# Altium project MB1936.PrjPcb (part 3 of 8)

## Sheet Ethernet2.SchDoc: ETHERNET 2
size A3; Date: Not used; ApprovedBy: Not used; CheckedBy: Not used; Author: Not used; CompanyName: STMicroelectronics; DrawnBy: Not used; Engineer: Not used; Organization: Not used; Address1: Not used; Address2: Not used; Address3: Not used; Address4: Not used; DocumentNumber: Not used; Revision: Not used; SheetNumber: 8; SheetTotal: 18; CurrentTime: Not used; CurrentDate: Not used; Time: Not used; DocumentFullPathAndName: Not used; DocumentName: Not used; ModifiedDate: Not used; ImagePath: Not used; ProjectName: Not used; Application_BuildNumber: Not used
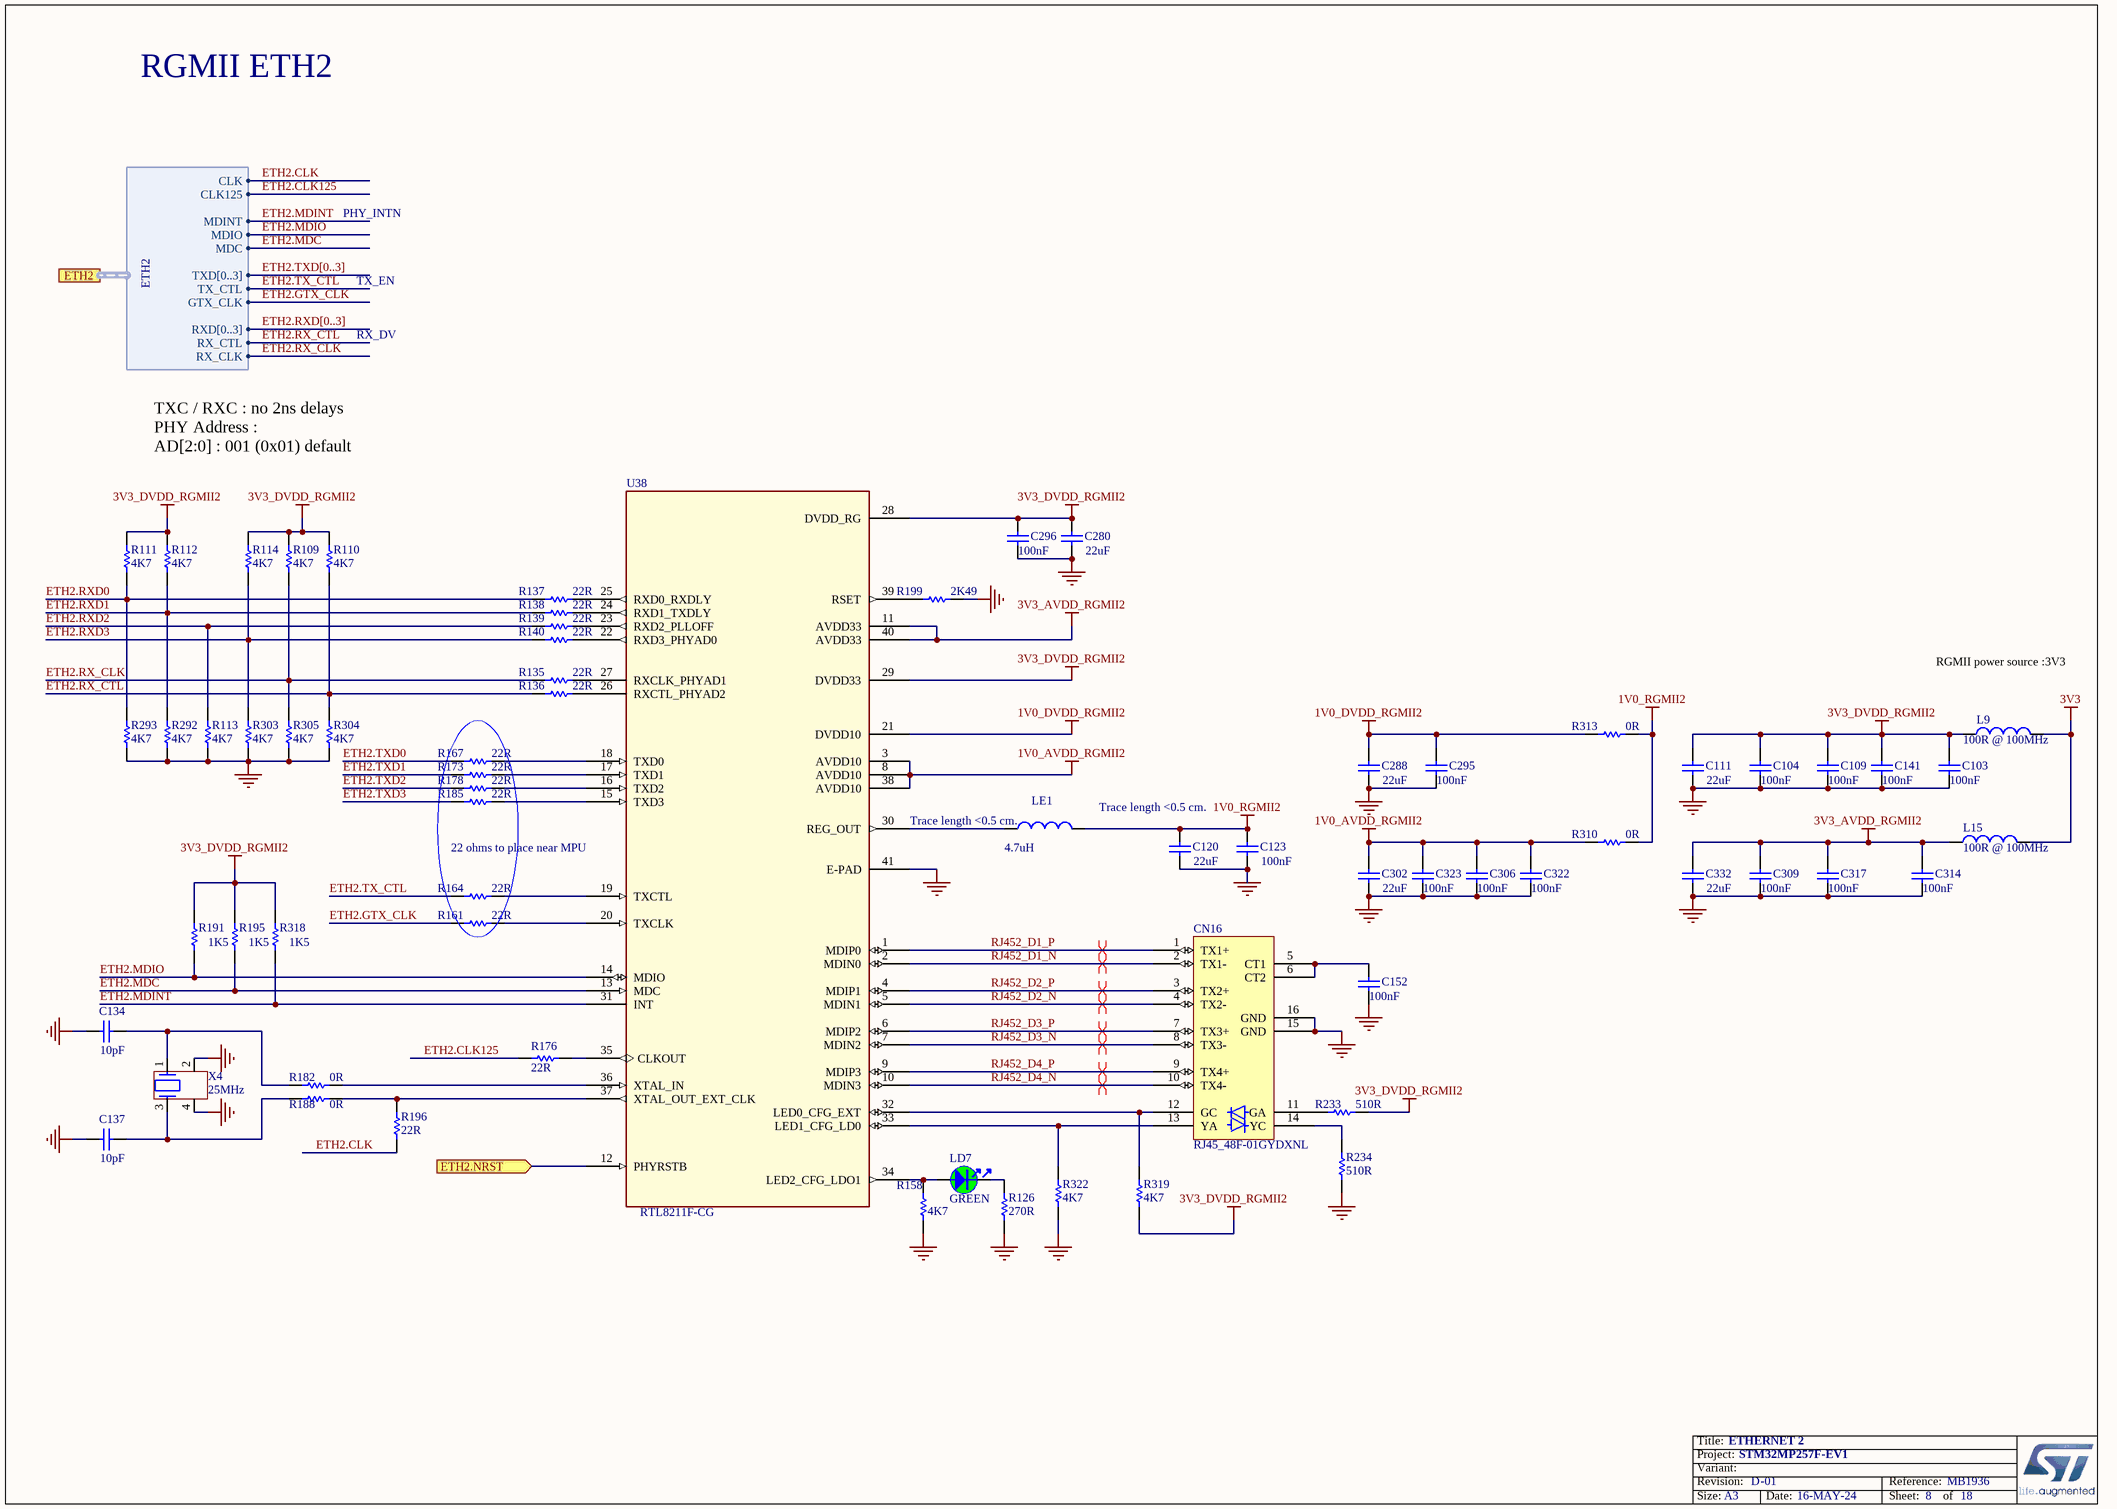
[diagram p7: Ethernet2.SchDoc]

### Parts
C103  value 100nF  [C0402]
C104  value 100nF  [C0402]
C109  value 100nF  [C0402]
C111  value 22uF  [C0603]
C120  value 22uF  [C0603]
C123  value 100nF  [C0402]
C134  value 10pF  [C0402]
C137  value 10pF  [C0402]
C141  value 100nF  [C0402]
C152  value 100nF  [C0402]
C280  value 22uF  [C0603]
C288  value 22uF  [C0603]
C295  value 100nF  [C0402]
C296  value 100nF  [C0402]
C302  value 22uF  [C0603]
C306  value 100nF  [C0402]
C309  value 100nF  [C0402]
C314  value 100nF  [C0402]
C317  value 100nF  [C0402]
C322  value 100nF  [C0402]
C323  value 100nF  [C0402]
C332  value 22uF  [C0603]
CN16  value RJ45_48F-01GYDXNL  [CON_RJ45_YD_48F-01GYDXNL_LED-P]  (hidden comment: ​New part for use of led pulled down on pin 13/14 , schematic more lisible.)
L9  value 100R @ 100MHz  [FIL_0603_H0P65]
L15  value 100R @ 100MHz  [FIL_0603_H0P65]
LD7  value GREEN  [LED_0603_OSRAM_LG-Q396-PS-35_GREEN_1A2K_H0P4]  (hidden comment: LED_green)
LE1  value 4.7uH  [L1210_LQH]
R109  value 4K7  [R0402]
R110  value 4K7  [R0402]
R111  value 4K7  [R0402]
R112  value 4K7  [R0402]
R113  value 4K7  [R0402]
R114  value 4K7  [R0402]
R126  value 270R  [R0402]  (hidden comment: Resistor)
R135  value 22R  [R0201_H0P23]  (hidden comment: Resistor)
R136  value 22R  [R0201_H0P23]  (hidden comment: Resistor)
R137  value 22R  [R0201_H0P23]  (hidden comment: Resistor)
R138  value 22R  [R0201_H0P23]  (hidden comment: Resistor)
R139  value 22R  [R0201_H0P23]  (hidden comment: Resistor)
R140  value 22R  [R0201_H0P23]  (hidden comment: Resistor)
R158  value 4K7  [R0402]
R161  value 22R  [R0201_H0P23]  (hidden comment: Resistor)
R164  value 22R  [R0201_H0P23]  (hidden comment: Resistor)
R167  value 22R  [R0201_H0P23]  (hidden comment: Resistor)
R173  value 22R  [R0201_H0P23]  (hidden comment: Resistor)
R176  value 22R  [R0201_H0P23]  (hidden comment: Resistor)
R178  value 22R  [R0201_H0P23]  (hidden comment: Resistor)
R182  value 0R  [R0402]
R185  value 22R  [R0201_H0P23]  (hidden comment: Resistor)
R188  value 0R  [R0402]
R191  value 1K5  [R0402]
R195  value 1K5  [R0402]
R196  value 22R  [R0201_H0P23]  (hidden comment: Resistor)
R199  value 2K49  [R0402]
R233  value 510R  [R0402]
R234  value 510R  [R0402]
R292  value 4K7  [R0402]
R293  value 4K7  [R0402]
R303  value 4K7  [R0402]
R304  value 4K7  [R0402]
R305  value 4K7  [R0402]
R310  value 0R  [R0603]
R313  value 0R  [R0603]
R318  value 1K5  [R0402]
R319  value 4K7  [R0402]
R322  value 4K7  [R0402]
U38  RTL8211F-CG  [ICC_QFN40-EPAD_5X5_P040]
X4  value 25MHz  [CRY_NX3225HA_4P]  (hidden comment: XTAL_4_PINS)

### Ports
ETH2 (harness ETH2), ETH2.NRST (in)

### Harnesses
ETH2: MDINT, CLK125, TXD[0..3], MDIO, MDC, RX_CLK, GTX_CLK, TX_CTL, RXD[0..3], RX_CTL, CLK

### Nets
1V0_AVDD_RGMII2: C302.2 C306.2 C322.2 C323.2 R310.1 U38.3(AVDD10) U38.8(AVDD10) U38.38(AVDD10)
1V0_DVDD_RGMII2: C288.2 C295.2 R313.1 U38.21(DVDD10)
1V0_RGMII2: C120.2 C123.2 LE1.2 R310.2 R313.2
3V3: L9.2 L15.2
3V3_AVDD_RGMII2: C309.2 C314.2 C317.2 C332.2 L15.1 U38.11(AVDD33) U38.40(AVDD33)
3V3_DVDD_RGMII2: C103.2 C104.2 C109.2 C111.2 C141.2 C280.1 C296.2 L9.1 R109.2 R110.2 R111.2 R112.2 R114.2 R191.2 R195.2 R233.2 R318.2 R319.1 U38.28(DVDD_RG) U38.29(DVDD33)
GND: C103.1 C104.1 C109.1 C111.1 C120.1 C123.1 C134.1 C137.1 C141.1 C152.1 C280.2 C288.1 C295.1 C296.1 C302.1 C306.1 C309.1 C314.1 C317.1 C322.1 C323.1 C332.1 CN16.15(GND) CN16.16(GND) R113.1 R126.2 R158.1 R199.2 R234.1 R292.1 R293.1 R303.1 R304.1 R305.1 R322.1 U38.41(E-PAD) X4.2 X4.4
ETH2.CLK: R196.1 ; port ETH2.CLK
ETH2.CLK125: R176.1 ; port ETH2.CLK125
ETH2.GTX_CLK: R161.1 ; port ETH2.GTX_CLK
ETH2.MDC: R195.1 U38.13(MDC) ; port ETH2.MDC
ETH2.MDINT: R318.1 U38.31(INT) ; port ETH2.MDINT
ETH2.MDIO: R191.1 U38.14(MDIO) ; port ETH2.MDIO
ETH2.NRST: U38.12(PHYRSTB) ; port ETH2.NRST
ETH2.RX_CLK: R109.1 R135.1 R305.2 ; port ETH2.RX_CLK
ETH2.RX_CTL: R110.1 R136.1 R304.2 ; port ETH2.RX_CTL
ETH2.RXD0: R111.1 R137.1 R293.2
ETH2.RXD1: R112.1 R138.1 R292.2
ETH2.RXD2: R113.2 R139.1
ETH2.RXD3: R114.1 R140.1 R303.2
ETH2.TX_CTL: R164.1 ; port ETH2.TX_CTL
ETH2.TXD0: R167.1
ETH2.TXD1: R173.1
ETH2.TXD2: R178.1
ETH2.TXD3: R185.1
RJ452_D1_N: CN16.2(TX1-) U38.2(MDIN0)
RJ452_D1_P: CN16.1(TX1+) U38.1(MDIP0)
RJ452_D2_N: CN16.4(TX2-) U38.5(MDIN1)
RJ452_D2_P: CN16.3(TX2+) U38.4(MDIP1)
RJ452_D3_N: CN16.8(TX3-) U38.7(MDIN2)
RJ452_D3_P: CN16.7(TX3+) U38.6(MDIP2)
RJ452_D4_N: CN16.10(TX4-) U38.10(MDIN3)
RJ452_D4_P: CN16.9(TX4+) U38.9(MDIP3)
NetC134_2: C134.2 R182.1 X4.1
NetC137_2: C137.2 R188.1 X4.3
NetC152_2: C152.2 CN16.5(CT1) CN16.6(CT2)
NetCN16_11: CN16.11(GA) R233.1
NetCN16_12: CN16.12(GC) R319.2 U38.32(LED0_CFG_EXT)
NetCN16_13: CN16.13(YA) R322.2 U38.33(LED1_CFG_LD0)
NetCN16_14: CN16.14(YC) R234.2
NetLD7_1: LD7.1 R158.2 U38.34(LED2_CFG_LDO1)
NetLD7_2: LD7.2 R126.1
NetLE1_1: LE1.1 U38.30(REG_OUT)
NetR135_2: R135.2 U38.27(RXCLK_PHYAD1)
NetR136_2: R136.2 U38.26(RXCTL_PHYAD2)
NetR137_2: R137.2 U38.25(RXD0_RXDLY)
NetR138_2: R138.2 U38.24(RXD1_TXDLY)
NetR139_2: R139.2 U38.23(RXD2_PLLOFF)
NetR140_2: R140.2 U38.22(RXD3_PHYAD0)
NetR161_2: R161.2 U38.20(TXCLK)
NetR164_2: R164.2 U38.19(TXCTL)
NetR167_2: R167.2 U38.18(TXD0)
NetR173_2: R173.2 U38.17(TXD1)
NetR176_2: R176.2 U38.35(CLKOUT)
NetR178_2: R178.2 U38.16(TXD2)
NetR182_2: R182.2 U38.36(XTAL_IN)
NetR185_2: R185.2 U38.15(TXD3)
NetR188_2: R188.2 R196.2 U38.37(XTAL_OUT_EXT_CLK)
NetR199_1: R199.1 U38.39(RSET)

### Buses and harness runs
bus ETH2.RXD[0..3]
bus ETH2.TXD[0..3]

### Layout directives
differential pair: RJ452_D1_N, RJ452_D1_P, RJ452_D2_N, RJ452_D2_P, RJ452_D3_N, RJ452_D3_P, RJ452_D4_N, RJ452_D4_P

### Notes on the sheet
- RGMII ETH2
- PHY_INTN
- TX_EN
- RX_DV
- TXC / RXC : no 2ns delays
  PHY Address :
  AD[2:0] : 001 (0x01) default
- RGMII power source :3V3
- (near U38) 22 ohms to place near MPU
- (near LE1) Trace length <0.5 cm.
- Trace length <0.5 cm.
- Title:
- Project:
- Size:
- Revision:
- Variant:
- A3
- -
- Date:
- Reference:
- Sheet:
- of

### Library data of the parts
C103 C104 C109 C123 C141 C152 C295 C296 C306 C309 C314 C317 C322 C323 = MCD-00006: Capacitor,100nF,16V,X7R,10%,0402; Manufacturer_Part_Number: CC0402KRX7R7BB104; Manufacturer: YAGEO; Alternate_Manufacturer: MURATA; Alternate_Manufacturer_Part_Number: GCM155R71C104KA55D; Part_Preference: Recommended; Provided_By: SUBCO; Initial_Board_Reference: mb1274; Order_Code_RS: 616-9701; Component_Country_Of_Origin: China; ID: 2474; ShowFields: YES; Internal_Part_Number: MCD-00006; ComponentLink1Description: Datasheet; ECCN_US: n/a; ECCN_EU: n/a; Status: Released; Part_Type: Capacitor; Package: 0402; ComponentLink1URL: http://tunmcdsvn.tun.st.com/Component_Documentation_Library/Trunk/Capacitor/YAGEO_X7R_Series; Order_Code_Digikey: 311-1338-1-ND; Order_Code_Farnell: 9402047
C111 C120 C280 C288 C302 C332 = MCD-00100: Capacitor,22uF,6V3,X5R,20%,0603; Manufacturer_Part_Number: GRM188R60J226MEA0J; Manufacturer: MURATA; Part_Preference: Recommended; ECCN_US: EAR99; ECCN_EU: NEC; Provided_By: SUBCO; Initial_Board_Reference: mb1262; Component_Country_Of_Origin: Japan; ID: 2766; ShowFields: YES; Internal_Part_Number: MCD-00100; ComponentLink1Description: Datasheet; Status: Released; Part_Type: Capacitor; Package: 0603; ComponentLink1URL: http://tunmcdsvn.tun.st.com/Component_Documentation_Library/Trunk/Capacitor/MURATA_GRM_Series; Order_Code_Digikey: 490-7612-2-ND; Order_Code_Farnell: N/A; Order_Code_RS: N/A
C134 C137 = MCD-00015: Capacitor,10pF,50V,NPO,5%,0402; Manufacturer_Part_Number: CC0402JRNPO9BN100; Manufacturer: YAGEO; Part_Preference: Recommended; Provided_By: SUBCO; Initial_Board_Reference: mb1274; Order_Code_RS: 616-9256; Component_Country_Of_Origin: China; ID: 2465; ShowFields: YES; Internal_Part_Number: MCD-00015; ComponentLink1Description: Datasheet; ECCN_US: n/a; ECCN_EU: n/a; Status: Released; Part_Type: Capacitor; Package: 0402; ComponentLink1URL: http://tunmcdsvn.tun.st.com/Component_Documentation_Library/Trunk/Capacitor/YAGEO_NP0_Series; Order_Code_Digikey: 311-1014-1-ND; Order_Code_Farnell: 3019160RL
CN16 = MCD-01129: Connector_RJ45, led pull down, T= 13.84mm; Manufacturer_Part_Number: 48F-01GYDXNL; Manufacturer: YUAN DEAN SCIENTIFIC; Part_Preference: Recommended; Component_Country_Of_Origin: Unknown; ID: 3367; ShowFields: YES; Internal_Part_Number: MCD-01129; Status: New; Part_Type: Connector; ComponentLink1URL: http://tunmcdsvn.tun.st.com/Component_Documentation_Library/Trunk/Connector/YUAN_DEAN_SCIENTIFIC_48F_Series/; Order_Code_Digikey: N/A; Order_Code_Farnell: N/A; Order_Code_RS: N/A
L9 L15 = MCD-00094: Ferrite bead 100R 2A 0603; Manufacturer_Part_Number: BLM18EG101TN1; Manufacturer: MURATA; Part_Type: Inductor; Part_Preference: Recommended; ECCN_US: EAR99; ECCN_EU: NEC; Provided_By: SUBCO; Initial_Board_Reference: mb1262; Order_Code_RS: 792-6246; Component_Country_Of_Origin: Japan; ID: 2774; ShowFields: YES; Internal_Part_Number: MCD-00094; ComponentLink1Description: Datasheet; Status: Released; ComponentLink1URL: http://tunmcdsvn.tun.st.com/Component_Documentation_Library/Trunk/Inductor/MURATA_BLM_Series; Order_Code_Digikey: 490-5978-2-ND; Order_Code_Farnell: 1515714; Package: 0603
LD7 = MCD-00588: LED Green, 0603 SMD, Forward Voltage Typ=2V, Max=2.5V; Part_Type: Display; Manufacturer_Part_Number: LG Q396-PS-35; Manufacturer: OSRAM OPTO SEMICONDUCTORS; Alternate_Manufacturer_Part_Number: VLMTG1300-GS08; Alternate_Manufacturer: VISHAY SEMICONDUCTOR OPTO DIVISION; Alternate_Internal_Part_Number: MCD-02400; Part_Preference: Recommended; Provided_By: SUBCO; Component_Country_Of_Origin: Unknown; ID: 3155; ShowFields: YES; Internal_Part_Number: MCD-00588; Status: Released; Package: LED 0603; ComponentLink1Description: Datasheet; ComponentLink1URL: http://tunmcdsvn.tun.st.com/Component_Datasheet_Library/Trunk/Display/OSRAM_LED_GREEN_LG Q396-PS-35; Order_Code_Digikey: LG Q396-PS-35-ND; ECCN_US: n/a; ECCN_EU: n/a
LE1 = MCD-00048: FIXED IND 4.7UH 1A 180 MOHM 30% SMD; Manufacturer_Part_Number: LQH32PN4R7NN0L; Manufacturer: MURATA; Part_Preference: Recommended; Provided_By: SUBCO; Initial_Board_Reference: mb1274; Order_Code_RS: 167-4086; Component_Country_Of_Origin: Japan; ID: 2544; ShowFields: YES; Internal_Part_Number: MCD-00048; ComponentLink1Description: Datasheet; ECCN_US: n/a; ECCN_EU: n/a; Status: Released; Part_Type: Inductor; ComponentLink1URL: http://tunmcdsvn.tun.st.com/Component_Documentation_Library/Trunk/Inductor/MURATA_LQH32PN4R7NN0; Order_Code_Digikey: 490-5338-2-ND; Order_Code_Farnell: 2470296; Package: 1210
R109-R114 R292 R293 R303-R305 = MCD-00065: Resistor,4K7,0402,1%,1/16W; Manufacturer_Part_Number: RC0402FR-074K7L; Manufacturer: YAGEO; Alternate_Manufacturer_Part_Number: RT0402FRE074K7L; Provided_By: SUBCO; Initial_Board_Reference: mb1274; Internal_Part_Number: MCD-00065; Alternate_Manufacturer: YAGEO; ComponentLink1Description: Datasheet; ECCN_US: n/a; ECCN_EU: n/a; Status: Released; Part_Type: Resistor; ComponentLink1URL: http://tunmcdsvn.tun.st.com/Component_Datasheet_Library/Trunk/Resistors/Yageo_Resistor_RC0402-series; Package: R0402
R126 = MCD-00441: Resistor,270R,0402,1%,1/16W; Manufacturer_Part_Number: RC0402FR-07270RL; Manufacturer: YAGEO; Part_Preference: Recommended; Provided_By: SUBCO; ECCN_US: EAR99; ECCN_EU: NEC; Component_Country_Of_Origin: China; ID: 2838; ShowFields: YES; Internal_Part_Number: MCD-00441; Status: Released; Part_Type: Resistor; Package: 0402; ComponentLink1Description: Datasheet; ComponentLink1URL: http://tunmcdsvn.tun.st.com/Component_Documentation_Library/Trunk/Resistor/YAGEO_RC_L_Series; Order_Code_Digikey: 311-270LRCT-ND; Order_Code_Farnell: 9239162; Order_Code_RS: N/A
R135-R140 R161 R164 R167 R173 R176 R178 R185 R196 = MCD-02978: as R141-R146 on sheet Ethernet1; Internal_Part_Number: MCD-02978; Status: New; Part_Type: Resistor; ComponentLink1URL: http://tunmcdsvn.tun.st.com/Component_Documentation_Library/Trunk/Resistor/YAGEO_RC_L_Series; Package: 0201; Order_Code_Digikey: YAG2518TR-ND; Order_Code_Farnell: 2693564
R158 R319 R322 = MCD-00065: Resistor,4K7,0402,1%,1/16W; Manufacturer_Part_Number: RC0402FR-074K7L; Manufacturer: YAGEO; Alternate_Manufacturer_Part_Number: RT0402FRE074K7L; Part_Preference: Recommended; Provided_By: SUBCO; Initial_Board_Reference: mb1274; Component_Country_Of_Origin: China; ID: 2526; ShowFields: YES; Internal_Part_Number: MCD-00065; Alternate_Manufacturer: YAGEO; ComponentLink1Description: Datasheet; ECCN_US: n/a; ECCN_EU: n/a; Status: Released; Part_Type: Resistor; ComponentLink1URL: http://tunmcdsvn.tun.st.com/Component_Documentation_Library/Trunk/Resistor/YAGEO_RC_L_Series; Package: 0402; Order_Code_Digikey: 311-4.7KLRCT-ND; Order_Code_Farnell: 9239316; Order_Code_RS: N/A
R182 R188 = MCD-00052: Resistor,0R,0402,5%,1/16W; Manufacturer_Part_Number: RC0402JR-070RL; Manufacturer: YAGEO; Part_Preference: Recommended; Provided_By: SUBCO; Initial_Board_Reference: mb1274; Order_Code_RS: 618-5804; Component_Country_Of_Origin: China; ID: 2540; ShowFields: YES; Internal_Part_Number: MCD-00052; ComponentLink1Description: Datasheet; ECCN_US: n/a; ECCN_EU: n/a; Status: Released; Part_Type: Resistor; ComponentLink1URL: http://tunmcdsvn.tun.st.com/Component_Documentation_Library/Trunk/Resistor/YAGEO_RC_L_Series; Package: 0402; Order_Code_Digikey: 311-0.0JRCT-ND; Order_Code_Farnell: 9232516RL
R191 R195 R318 = MCD-00068: Resistor,1K5,0402,1%,1/16W; Manufacturer_Part_Number: RC0402FR-071K5L; Manufacturer: YAGEO; Part_Preference: Recommended; Provided_By: SUBCO; Initial_Board_Reference: mb1274; Component_Country_Of_Origin: China; ID: 2524; ShowFields: YES; Internal_Part_Number: MCD-00068; ComponentLink1Description: Datasheet; ECCN_US: n/a; ECCN_EU: n/a; Status: Released; Part_Type: Resistor; ComponentLink1URL: http://tunmcdsvn.tun.st.com/Component_Documentation_Library/Trunk/Resistor/YAGEO_RC_L_Series; Package: 0402; Order_Code_Digikey: 311-1.50KLRCT-ND; Order_Code_Farnell: 9239251; Order_Code_RS: N/A
R199 = MCD-00183: Resistor,2K49,0402,1%,1/16W; Manufacturer_Part_Number: RC0402FR-072K49L; Manufacturer: YAGEO; Part_Preference: Recommended; Provided_By: SUBCO; Component_Country_Of_Origin: China; ID: 2687; ShowFields: YES; Internal_Part_Number: MCD-00183; ComponentLink1Description: Datasheet; ECCN_US: n/a; ECCN_EU: n/a; Status: Released; Part_Type: Resistor; ComponentLink1URL: http://tunmcdsvn.tun.st.com/Component_Documentation_Library/Trunk/Resistor/YAGEO_RC_L_Series; Package: 0402; Order_Code_Digikey: 311-2.49KLRCT-ND; Order_Code_Farnell: 1799190; Order_Code_RS: N/A
R233 R234 = MCD-00064: Resistor,510R,0402,1%,1/16W; Manufacturer_Part_Number: RC0402FR-07510RL; Manufacturer: YAGEO; Part_Preference: Recommended; Provided_By: SUBCO; Initial_Board_Reference: mb1274; Component_Country_Of_Origin: China; ID: 2525; ShowFields: YES; Internal_Part_Number: MCD-00064; ComponentLink1Description: Datasheet; ECCN_US: n/a; ECCN_EU: n/a; Status: Released; Part_Type: Resistor; ComponentLink1URL: http://tunmcdsvn.tun.st.com/Component_Documentation_Library/Trunk/Resistor/YAGEO_RC_L_Series; Package: 0402; Order_Code_Digikey: 311-510LRCT-ND; Order_Code_Farnell: 1458804; Order_Code_RS: N/A
R310 R313 = MCD-00056: Resistor,0R,0603,5%,1/10W; Manufacturer_Part_Number: RC0603JR-070RL; Manufacturer: YAGEO; Part_Preference: Recommended; Provided_By: SUBCO; Initial_Board_Reference: mb1274; Component_Country_Of_Origin: China; ID: 2536; ShowFields: YES; Internal_Part_Number: MCD-00056; ComponentLink1Description: Datasheet; ECCN_US: n/a; ECCN_EU: n/a; Status: Released; Part_Type: Resistor; ComponentLink1URL: http://tunmcdsvn.tun.st.com/Component_Documentation_Library/Trunk/Resistor/YAGEO_RC_L_Series; Package: 0603; Order_Code_Digikey: 311-0.0GRCT-ND; Order_Code_Farnell: 9233130RL; Order_Code_RS: N/A
U38 = MCD-01130: 10/100/1000M GIGABIT Ethernet Transceiver, QFN40 , SMPS version; Manufacturer: REALTEK; Part_Type: IC; Part_Preference: Recommended; Provided_By: SUBCO; Initial_Board_Reference: MB1272; Component_Country_Of_Origin: Unknown; ID: 3370; ShowFields: YES; Value: RTL8211F-CG; Internal_Part_Number: MCD-01130; Manufacturer_Part_Number: RTL8211F-CG; ComponentLink1Description: Datasheet; ComponentLink1URL: http://tunmcdsvn.tun.st.com/Component_Datasheet_Library/Trunk/IC/REALTEK_RTL8211F_RGMII_phy; Status: Checked; ECCN_US: n/a; ECCN_EU: n/a
X4 = MCD-01463: Crystal 25Mhz, 10pF, -+50PPM, SMD; Part_Type: Crystal_Osc; Manufacturer_Part_Number: NX3225GA-25MHZ-EXS00A-CG06750; Manufacturer: NDK; BMS_Part_Number: 9157035; Part_Preference: Recommended; Provided_By: SUBCO; Initial_Board_Reference: MB1272B; Remark: footprint same as CRY_NX3225HA_4P; Component_Country_Of_Origin: Unknown; ID: 3563; ShowFields: YES; Internal_Part_Number: MCD-01463; Status: Checked; Package: 3.2x2.5mm; ComponentLink1Description: Datasheet; ComponentLink1URL: http://tunmcdsvn.tun.st.com/Component_Documentation_Library/Trunk/Crytal_Oscillator/NDK_NX3225GA_Series; Order_Code_Digikey: 644-1390; Order_Code_Farnell: N/A; Order_Code_RS: N/A

## Sheet Ethernet3.SchDoc: ETHERNET 3
size A3; Date: Not used; ApprovedBy: Not used; CheckedBy: Not used; Author: Not used; CompanyName: STMicroelectronics; DrawnBy: Not used; Engineer: Not used; Organization: Not used; Address1: Not used; Address2: Not used; Address3: Not used; Address4: Not used; DocumentNumber: Not used; Revision: Not used; SheetNumber: 9; SheetTotal: 18; CurrentTime: Not used; CurrentDate: Not used; Time: Not used; DocumentFullPathAndName: Not used; DocumentName: Not used; ModifiedDate: Not used; ImagePath: Not used; ProjectName: Not used; Application_BuildNumber: Not used
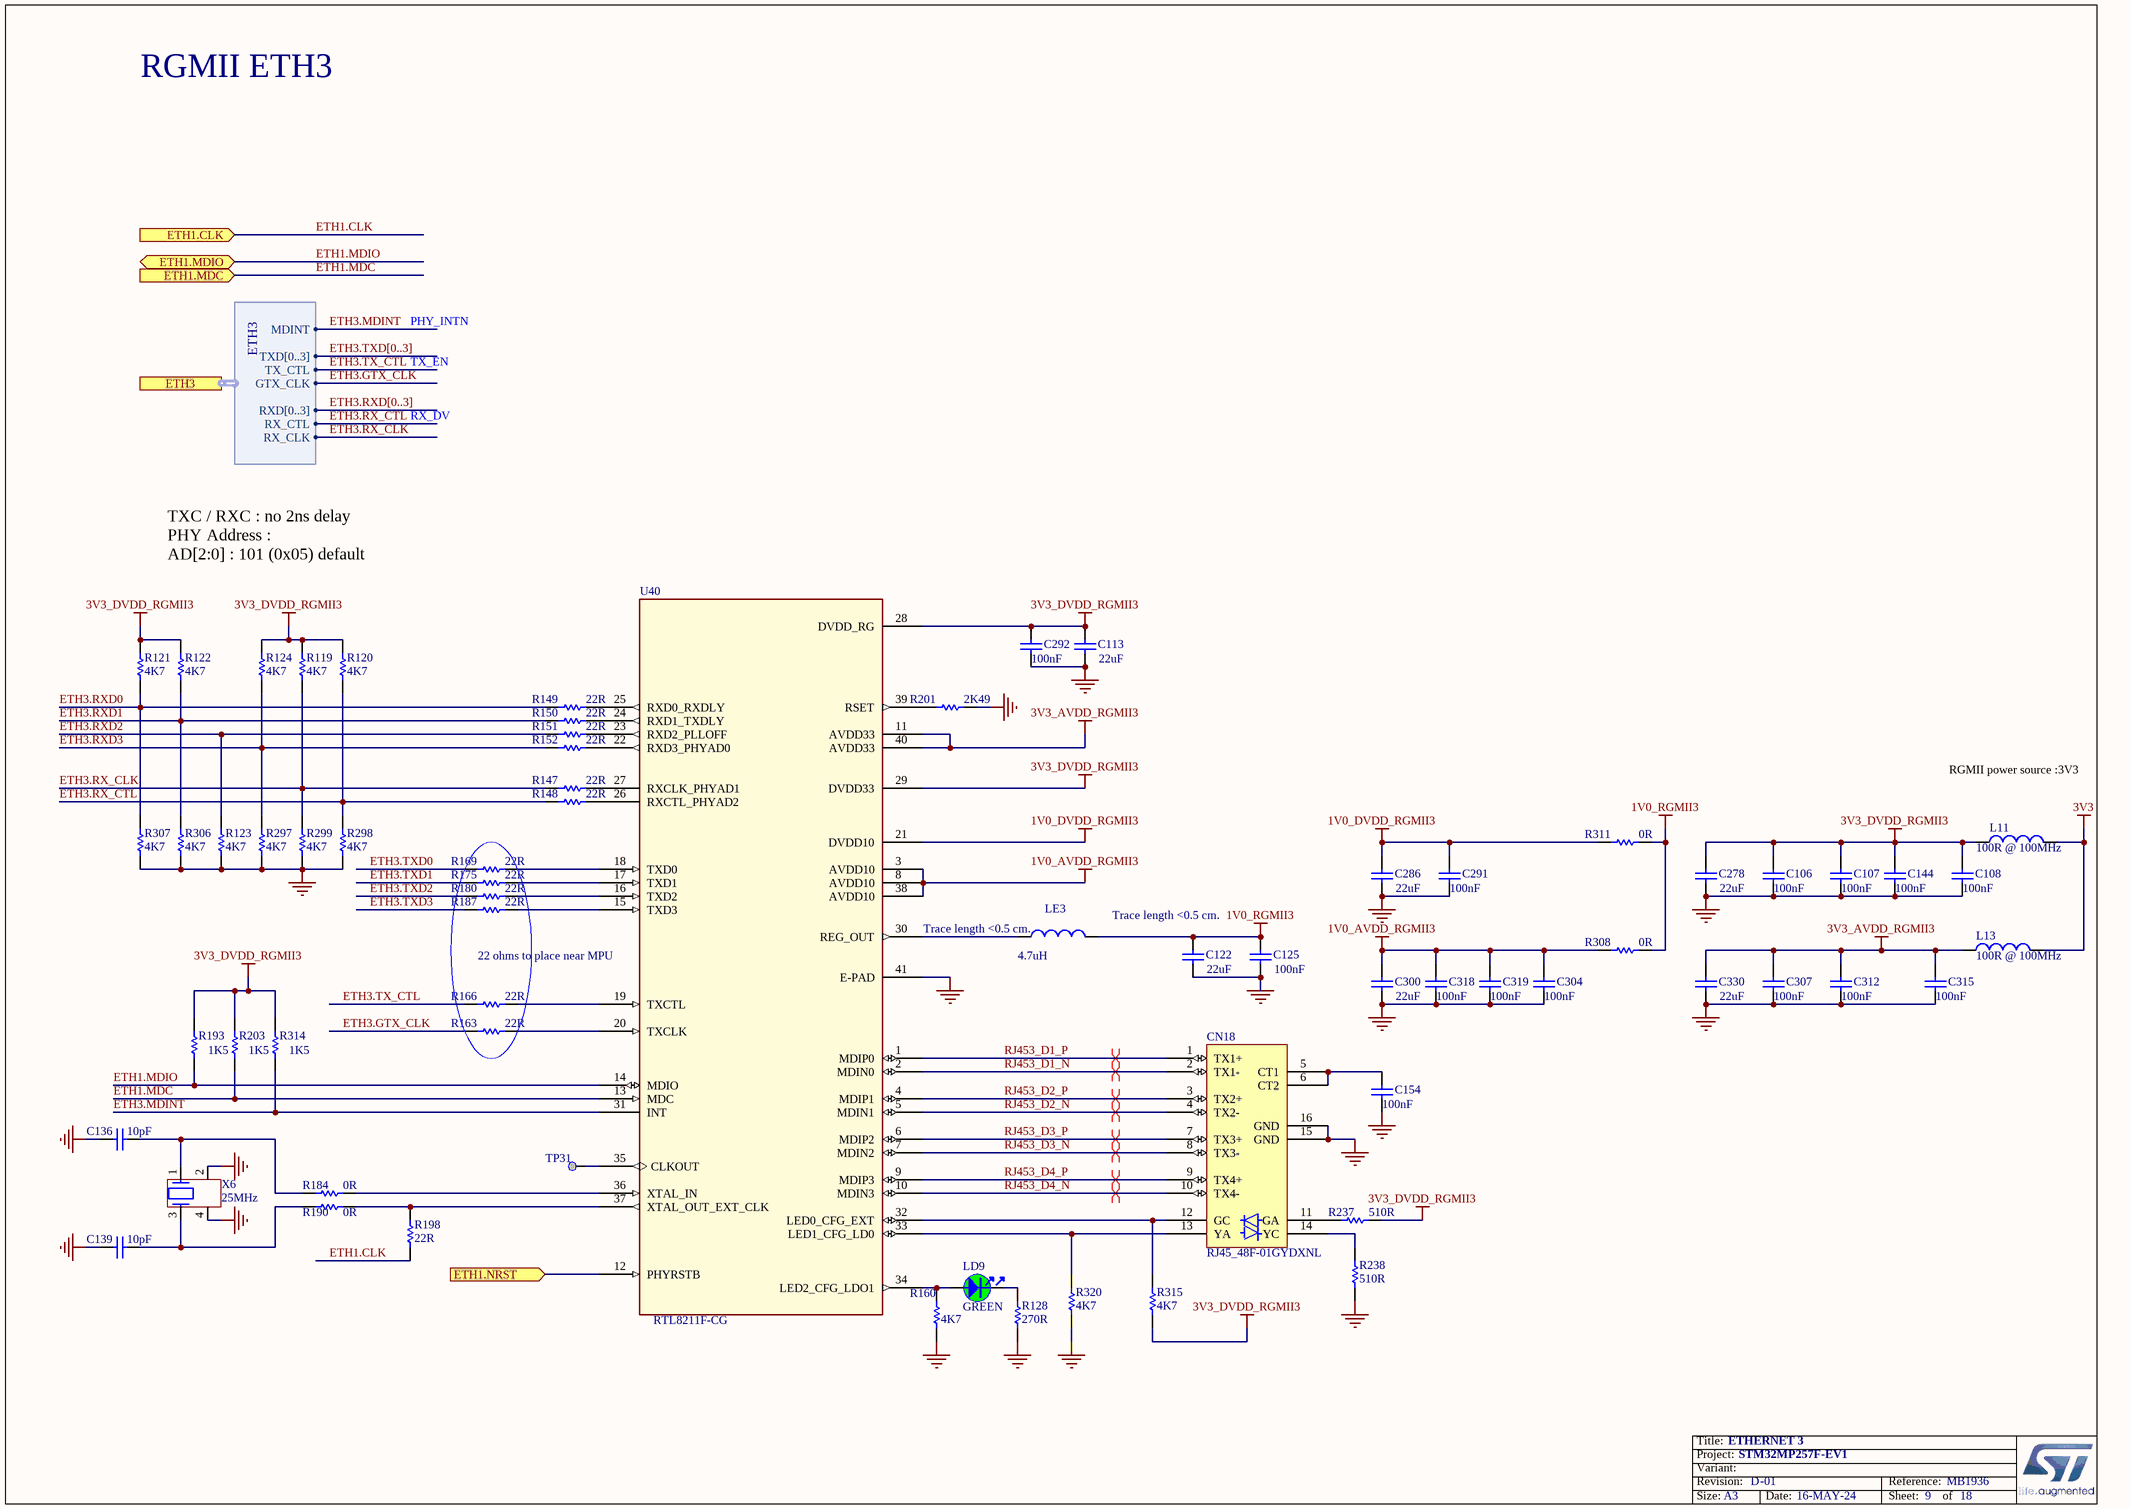
[diagram p8: Ethernet3.SchDoc]

### Parts
C106  value 100nF  [C0402]
C107  value 100nF  [C0402]
C108  value 100nF  [C0402]
C113  value 22uF  [C0603]
C122  value 22uF  [C0603]
C125  value 100nF  [C0402]
C136  value 10pF  [C0402]
C139  value 10pF  [C0402]
C144  value 100nF  [C0402]
C154  value 100nF  [C0402]
C278  value 22uF  [C0603]
C286  value 22uF  [C0603]
C291  value 100nF  [C0402]
C292  value 100nF  [C0402]
C300  value 22uF  [C0603]
C304  value 100nF  [C0402]
C307  value 100nF  [C0402]
C312  value 100nF  [C0402]
C315  value 100nF  [C0402]
C318  value 100nF  [C0402]
C319  value 100nF  [C0402]
C330  value 22uF  [C0603]
CN18  value RJ45_48F-01GYDXNL  [CON_RJ45_YD_48F-01GYDXNL_LED-P]  (hidden comment: ​New part for use of led pulled down on pin 13/14 , schematic more lisible.)
L11  value 100R @ 100MHz  [FIL_0603_H0P65]
L13  value 100R @ 100MHz  [FIL_0603_H0P65]
LD9  value GREEN  [LED_0603_OSRAM_LG-Q396-PS-35_GREEN_1A2K_H0P4]  (hidden comment: LED_green)
LE3  value 4.7uH  [L1210_LQH]
R119  value 4K7  [R0402]
R120  value 4K7  [R0402]
R121  value 4K7  [R0402]
R122  value 4K7  [R0402]
R123  value 4K7  [R0402]
R124  value 4K7  [R0402]
R128  value 270R  [R0402]  (hidden comment: Resistor)
R147  value 22R  [R0201_H0P23]  (hidden comment: Resistor)
R148  value 22R  [R0201_H0P23]  (hidden comment: Resistor)
R149  value 22R  [R0201_H0P23]  (hidden comment: Resistor)
R150  value 22R  [R0201_H0P23]  (hidden comment: Resistor)
R151  value 22R  [R0201_H0P23]  (hidden comment: Resistor)
R152  value 22R  [R0201_H0P23]  (hidden comment: Resistor)
R160  value 4K7  [R0402]
R163  value 22R  [R0201_H0P23]  (hidden comment: Resistor)
R166  value 22R  [R0201_H0P23]  (hidden comment: Resistor)
R169  value 22R  [R0201_H0P23]  (hidden comment: Resistor)
R175  value 22R  [R0201_H0P23]  (hidden comment: Resistor)
R180  value 22R  [R0201_H0P23]  (hidden comment: Resistor)
R184  value 0R  [R0402]
R187  value 22R  [R0201_H0P23]  (hidden comment: Resistor)
R190  value 0R  [R0402]
R193  value 1K5  [R0402]
R198  value 22R  [R0201_H0P23]  (hidden comment: Resistor)
R201  value 2K49  [R0402]
R203  value 1K5  [R0402]
R237  value 510R  [R0402]
R238  value 510R  [R0402]
R297  value 4K7  [R0402]
R298  value 4K7  [R0402]
R299  value 4K7  [R0402]
R306  value 4K7  [R0402]
R307  value 4K7  [R0402]
R308  value 0R  [R0603]
R311  value 0R  [R0603]
R314  value 1K5  [R0402]
R315  value 4K7  [R0402]
R320  value 4K7  [R0402]
TP31  Test Point  [TP_SMD_1MM]  (value not drawn)  (no BOM)
U40  RTL8211F-CG  [ICC_QFN40-EPAD_5X5_P040]
X6  value 25MHz  [CRY_NX3225HA_4P]  (hidden comment: XTAL_4_PINS)

### Ports
ETH1.CLK (in), ETH1.MDC (in), ETH1.MDIO (bidir), ETH1.NRST (in), ETH3 (harness ETH3)

### Harnesses
ETH3: MDINT, TXD[0..3], RX_CLK, GTX_CLK, TX_CTL, RXD[0..3], RX_CTL

### Nets
1V0_AVDD_RGMII3: C300.2 C304.2 C318.2 C319.2 R308.1 U40.3(AVDD10) U40.8(AVDD10) U40.38(AVDD10)
1V0_DVDD_RGMII3: C286.2 C291.2 R311.1 U40.21(DVDD10)
1V0_RGMII3: C122.2 C125.2 LE3.2 R308.2 R311.2
3V3: L11.2 L13.2
3V3_AVDD_RGMII3: C307.2 C312.2 C315.2 C330.2 L13.1 U40.11(AVDD33) U40.40(AVDD33)
3V3_DVDD_RGMII3: C106.2 C107.2 C108.2 C113.1 C144.2 C278.2 C292.2 L11.1 R119.2 R120.2 R121.2 R122.2 R124.2 R193.2 R203.2 R237.2 R314.2 R315.1 U40.28(DVDD_RG) U40.29(DVDD33)
GND: C106.1 C107.1 C108.1 C113.2 C122.1 C125.1 C136.1 C139.1 C144.1 C154.1 C278.1 C286.1 C291.1 C292.1 C300.1 C304.1 C307.1 C312.1 C315.1 C318.1 C319.1 C330.1 CN18.15(GND) CN18.16(GND) R123.1 R128.2 R160.1 R201.2 R238.1 R297.1 R298.1 R299.1 R306.1 R307.1 R320.1 U40.41(E-PAD) X6.2 X6.4
ETH1.CLK: R198.1 ; port ETH1.CLK
ETH1.MDC: R203.1 U40.13(MDC) ; port ETH1.MDC
ETH1.MDIO: R193.1 U40.14(MDIO) ; port ETH1.MDIO
ETH1.NRST: U40.12(PHYRSTB) ; port ETH1.NRST
ETH3.GTX_CLK: R163.1 ; port ETH3.GTX_CLK
ETH3.MDINT: R314.1 U40.31(INT) ; port ETH3.MDINT
ETH3.RX_CLK: R119.1 R147.1 R299.2 ; port ETH3.RX_CLK
ETH3.RX_CTL: R120.1 R148.1 R298.2 ; port ETH3.RX_CTL
ETH3.RXD0: R121.1 R149.1 R307.2
ETH3.RXD1: R122.1 R150.1 R306.2
ETH3.RXD2: R123.2 R151.1
ETH3.RXD3: R124.1 R152.1 R297.2
ETH3.TX_CTL: R166.1 ; port ETH3.TX_CTL
ETH3.TXD0: R169.1
ETH3.TXD1: R175.1
ETH3.TXD2: R180.1
ETH3.TXD3: R187.1
RJ453_D1_N: CN18.2(TX1-) U40.2(MDIN0)
RJ453_D1_P: CN18.1(TX1+) U40.1(MDIP0)
RJ453_D2_N: CN18.4(TX2-) U40.5(MDIN1)
RJ453_D2_P: CN18.3(TX2+) U40.4(MDIP1)
RJ453_D3_N: CN18.8(TX3-) U40.7(MDIN2)
RJ453_D3_P: CN18.7(TX3+) U40.6(MDIP2)
RJ453_D4_N: CN18.10(TX4-) U40.10(MDIN3)
RJ453_D4_P: CN18.9(TX4+) U40.9(MDIP3)
NetC136_2: C136.2 R184.1 X6.1
NetC139_2: C139.2 R190.1 X6.3
NetC154_2: C154.2 CN18.5(CT1) CN18.6(CT2)
NetCN18_11: CN18.11(GA) R237.1
NetCN18_12: CN18.12(GC) R315.2 U40.32(LED0_CFG_EXT)
NetCN18_13: CN18.13(YA) R320.2 U40.33(LED1_CFG_LD0)
NetCN18_14: CN18.14(YC) R238.2
NetLD9_1: LD9.1 R160.2 U40.34(LED2_CFG_LDO1)
NetLD9_2: LD9.2 R128.1
NetLE3_1: LE3.1 U40.30(REG_OUT)
NetR147_2: R147.2 U40.27(RXCLK_PHYAD1)
NetR148_2: R148.2 U40.26(RXCTL_PHYAD2)
NetR149_2: R149.2 U40.25(RXD0_RXDLY)
NetR150_2: R150.2 U40.24(RXD1_TXDLY)
NetR151_2: R151.2 U40.23(RXD2_PLLOFF)
NetR152_2: R152.2 U40.22(RXD3_PHYAD0)
NetR163_2: R163.2 U40.20(TXCLK)
NetR166_2: R166.2 U40.19(TXCTL)
NetR169_2: R169.2 U40.18(TXD0)
NetR175_2: R175.2 U40.17(TXD1)
NetR180_2: R180.2 U40.16(TXD2)
NetR184_2: R184.2 U40.36(XTAL_IN)
NetR187_2: R187.2 U40.15(TXD3)
NetR190_2: R190.2 R198.2 U40.37(XTAL_OUT_EXT_CLK)
NetR201_1: R201.1 U40.39(RSET)
NetTP31_1: TP31.1 U40.35(CLKOUT)

### Buses and harness runs
bus ETH3.RXD[0..3]
bus ETH3.TXD[0..3]

### Layout directives
differential pair: RJ453_D1_N, RJ453_D1_P, RJ453_D2_N, RJ453_D2_P, RJ453_D3_N, RJ453_D3_P, RJ453_D4_N, RJ453_D4_P

### Notes on the sheet
- RGMII ETH3
- PHY_INTN
- TX_EN
- RX_DV
- TXC / RXC : no 2ns delay
  PHY Address :
  AD[2:0] : 101 (0x05) default
- RGMII power source :3V3
- Trace length <0.5 cm.
- (near U40) 22 ohms to place near MPU
- (near LE3) Trace length <0.5 cm.
- Title:
- Project:
- Size:
- Revision:
- Variant:
- A3
- -
- Date:
- Reference:
- Sheet:
- of

### Library data of the parts
C106-C108 C125 C144 C154 C291 C292 C304 C307 C312 C315 C318 C319 = MCD-00006: as C103 on sheet Ethernet2; Internal_Part_Number: MCD-00006; ComponentLink1Description: Datasheet; ECCN_US: n/a; ECCN_EU: n/a; Status: Released; Part_Type: Capacitor; Package: 0402; ComponentLink1URL: http://tunmcdsvn.tun.st.com/Component_Documentation_Library/Trunk/Capacitor/YAGEO_X7R_Series; Order_Code_Digikey: 311-1338-1-ND; Order_Code_Farnell: 9402047
C113 C122 C278 C286 C300 C330 = MCD-00100: as C111 on sheet Ethernet2; Internal_Part_Number: MCD-00100; ComponentLink1Description: Datasheet; Status: Released; Part_Type: Capacitor; Package: 0603; ComponentLink1URL: http://tunmcdsvn.tun.st.com/Component_Documentation_Library/Trunk/Capacitor/MURATA_GRM_Series; Order_Code_Digikey: 490-7612-2-ND; Order_Code_Farnell: N/A; Order_Code_RS: N/A
C136 C139 = MCD-00015: as C134 on sheet Ethernet2; Internal_Part_Number: MCD-00015; ComponentLink1Description: Datasheet; ECCN_US: n/a; ECCN_EU: n/a; Status: Released; Part_Type: Capacitor; Package: 0402; ComponentLink1URL: http://tunmcdsvn.tun.st.com/Component_Documentation_Library/Trunk/Capacitor/YAGEO_NP0_Series; Order_Code_Digikey: 311-1014-1-ND; Order_Code_Farnell: 3019160RL
CN18 = MCD-01129: as CN16 on sheet Ethernet2; Internal_Part_Number: MCD-01129; Status: New; Part_Type: Connector; ComponentLink1URL: http://tunmcdsvn.tun.st.com/Component_Documentation_Library/Trunk/Connector/YUAN_DEAN_SCIENTIFIC_48F_Series/; Order_Code_Digikey: N/A; Order_Code_Farnell: N/A; Order_Code_RS: N/A
L11 L13 = MCD-00094: as L9 on sheet Ethernet2; Internal_Part_Number: MCD-00094; ComponentLink1Description: Datasheet; Status: Released; ComponentLink1URL: http://tunmcdsvn.tun.st.com/Component_Documentation_Library/Trunk/Inductor/MURATA_BLM_Series; Order_Code_Digikey: 490-5978-2-ND; Order_Code_Farnell: 1515714; Package: 0603
LD9 = MCD-00588: as LD7 on sheet Ethernet2; Internal_Part_Number: MCD-00588; Status: Released; Package: LED 0603; ComponentLink1Description: Datasheet; ComponentLink1URL: http://tunmcdsvn.tun.st.com/Component_Datasheet_Library/Trunk/Display/OSRAM_LED_GREEN_LG Q396-PS-35; Order_Code_Digikey: LG Q396-PS-35-ND; ECCN_US: n/a; ECCN_EU: n/a
LE3 = MCD-00048: as LE1 on sheet Ethernet2; Internal_Part_Number: MCD-00048; ComponentLink1Description: Datasheet; ECCN_US: n/a; ECCN_EU: n/a; Status: Released; Part_Type: Inductor; ComponentLink1URL: http://tunmcdsvn.tun.st.com/Component_Documentation_Library/Trunk/Inductor/MURATA_LQH32PN4R7NN0; Order_Code_Digikey: 490-5338-2-ND; Order_Code_Farnell: 2470296; Package: 1210
R119-R124 R297-R299 R306 R307 = MCD-00065: as R109 on sheet Ethernet2; Internal_Part_Number: MCD-00065; Alternate_Manufacturer: YAGEO; ComponentLink1Description: Datasheet; ECCN_US: n/a; ECCN_EU: n/a; Status: Released; Part_Type: Resistor; ComponentLink1URL: http://tunmcdsvn.tun.st.com/Component_Datasheet_Library/Trunk/Resistors/Yageo_Resistor_RC0402-series; Package: R0402
R128 = MCD-00441: as R126 on sheet Ethernet2; Internal_Part_Number: MCD-00441; Status: Released; Part_Type: Resistor; Package: 0402; ComponentLink1Description: Datasheet; ComponentLink1URL: http://tunmcdsvn.tun.st.com/Component_Documentation_Library/Trunk/Resistor/YAGEO_RC_L_Series; Order_Code_Digikey: 311-270LRCT-ND; Order_Code_Farnell: 9239162; Order_Code_RS: N/A
R147-R152 R163 R166 R169 R175 R180 R187 R198 = MCD-02978: as R141-R146 on sheet Ethernet1; Internal_Part_Number: MCD-02978; Status: New; Part_Type: Resistor; ComponentLink1URL: http://tunmcdsvn.tun.st.com/Component_Documentation_Library/Trunk/Resistor/YAGEO_RC_L_Series; Package: 0201; Order_Code_Digikey: YAG2518TR-ND; Order_Code_Farnell: 2693564
R160 R315 R320 = MCD-00065: as R158 on sheet Ethernet2; Internal_Part_Number: MCD-00065; Alternate_Manufacturer: YAGEO; ComponentLink1Description: Datasheet; ECCN_US: n/a; ECCN_EU: n/a; Status: Released; Part_Type: Resistor; ComponentLink1URL: http://tunmcdsvn.tun.st.com/Component_Documentation_Library/Trunk/Resistor/YAGEO_RC_L_Series; Package: 0402; Order_Code_Digikey: 311-4.7KLRCT-ND; Order_Code_Farnell: 9239316; Order_Code_RS: N/A
R184 R190 = MCD-00052: as R182 on sheet Ethernet2; Internal_Part_Number: MCD-00052; ComponentLink1Description: Datasheet; ECCN_US: n/a; ECCN_EU: n/a; Status: Released; Part_Type: Resistor; ComponentLink1URL: http://tunmcdsvn.tun.st.com/Component_Documentation_Library/Trunk/Resistor/YAGEO_RC_L_Series; Package: 0402; Order_Code_Digikey: 311-0.0JRCT-ND; Order_Code_Farnell: 9232516RL
R193 R203 R314 = MCD-00068: as R191 on sheet Ethernet2; Internal_Part_Number: MCD-00068; ComponentLink1Description: Datasheet; ECCN_US: n/a; ECCN_EU: n/a; Status: Released; Part_Type: Resistor; ComponentLink1URL: http://tunmcdsvn.tun.st.com/Component_Documentation_Library/Trunk/Resistor/YAGEO_RC_L_Series; Package: 0402; Order_Code_Digikey: 311-1.50KLRCT-ND; Order_Code_Farnell: 9239251; Order_Code_RS: N/A
R201 = MCD-00183: as R199 on sheet Ethernet2; Internal_Part_Number: MCD-00183; ComponentLink1Description: Datasheet; ECCN_US: n/a; ECCN_EU: n/a; Status: Released; Part_Type: Resistor; ComponentLink1URL: http://tunmcdsvn.tun.st.com/Component_Documentation_Library/Trunk/Resistor/YAGEO_RC_L_Series; Package: 0402; Order_Code_Digikey: 311-2.49KLRCT-ND; Order_Code_Farnell: 1799190; Order_Code_RS: N/A
R237 R238 = MCD-00064: as R233 on sheet Ethernet2; Internal_Part_Number: MCD-00064; ComponentLink1Description: Datasheet; ECCN_US: n/a; ECCN_EU: n/a; Status: Released; Part_Type: Resistor; ComponentLink1URL: http://tunmcdsvn.tun.st.com/Component_Documentation_Library/Trunk/Resistor/YAGEO_RC_L_Series; Package: 0402; Order_Code_Digikey: 311-510LRCT-ND; Order_Code_Farnell: 1458804; Order_Code_RS: N/A
R308 R311 = MCD-00056: as R310 on sheet Ethernet2; Internal_Part_Number: MCD-00056; ComponentLink1Description: Datasheet; ECCN_US: n/a; ECCN_EU: n/a; Status: Released; Part_Type: Resistor; ComponentLink1URL: http://tunmcdsvn.tun.st.com/Component_Documentation_Library/Trunk/Resistor/YAGEO_RC_L_Series; Package: 0603; Order_Code_Digikey: 311-0.0GRCT-ND; Order_Code_Farnell: 9233130RL; Order_Code_RS: N/A
TP31 = MCD-00074: Test Point 1mm; Part_Type: Misc; Part_Preference: Recommended; Initial_Board_Reference: MB1274; ID: 2518; ShowFields: YES; Internal_Part_Number: MCD-00074; Status: Released; Manufacturer_Part_Number: n/a; Manufacturer: n/a; ComponentLink1Description: Datasheet; ComponentLink1URL: http://na; ECCN_US: n/a; ECCN_EU: n/a; Provided_By: n/a; Order_Code_Digikey: N/A; Order_Code_Farnell: N/A; Order_Code_RS: N/A
U40 = MCD-01130: as U38 on sheet Ethernet2; Value: RTL8211F-CG; Internal_Part_Number: MCD-01130; Manufacturer_Part_Number: RTL8211F-CG; ComponentLink1Description: Datasheet; ComponentLink1URL: http://tunmcdsvn.tun.st.com/Component_Datasheet_Library/Trunk/IC/REALTEK_RTL8211F_RGMII_phy; Status: Checked; ECCN_US: n/a; ECCN_EU: n/a
X6 = MCD-01463: as X4 on sheet Ethernet2; Internal_Part_Number: MCD-01463; Status: Checked; Package: 3.2x2.5mm; ComponentLink1Description: Datasheet; ComponentLink1URL: http://tunmcdsvn.tun.st.com/Component_Documentation_Library/Trunk/Crytal_Oscillator/NDK_NX3225GA_Series; Order_Code_Digikey: 644-1390; Order_Code_Farnell: N/A; Order_Code_RS: N/A

## Sheet Peripherals.SchDoc: Peripherals
size A3; Date: 01-DEC-2013; CompanyName: STMicroelectronics; Organization: Microcontrollers Division; Address1: 12, Rue Jules HOROWITZ; Address2: 38019 Grenoble; Address3: FRANCE; DocumentNumber: MB1272; Revision: A-01; SheetNumber: 17; SheetTotal: 18; Project: STM32MP15-DISCO PI
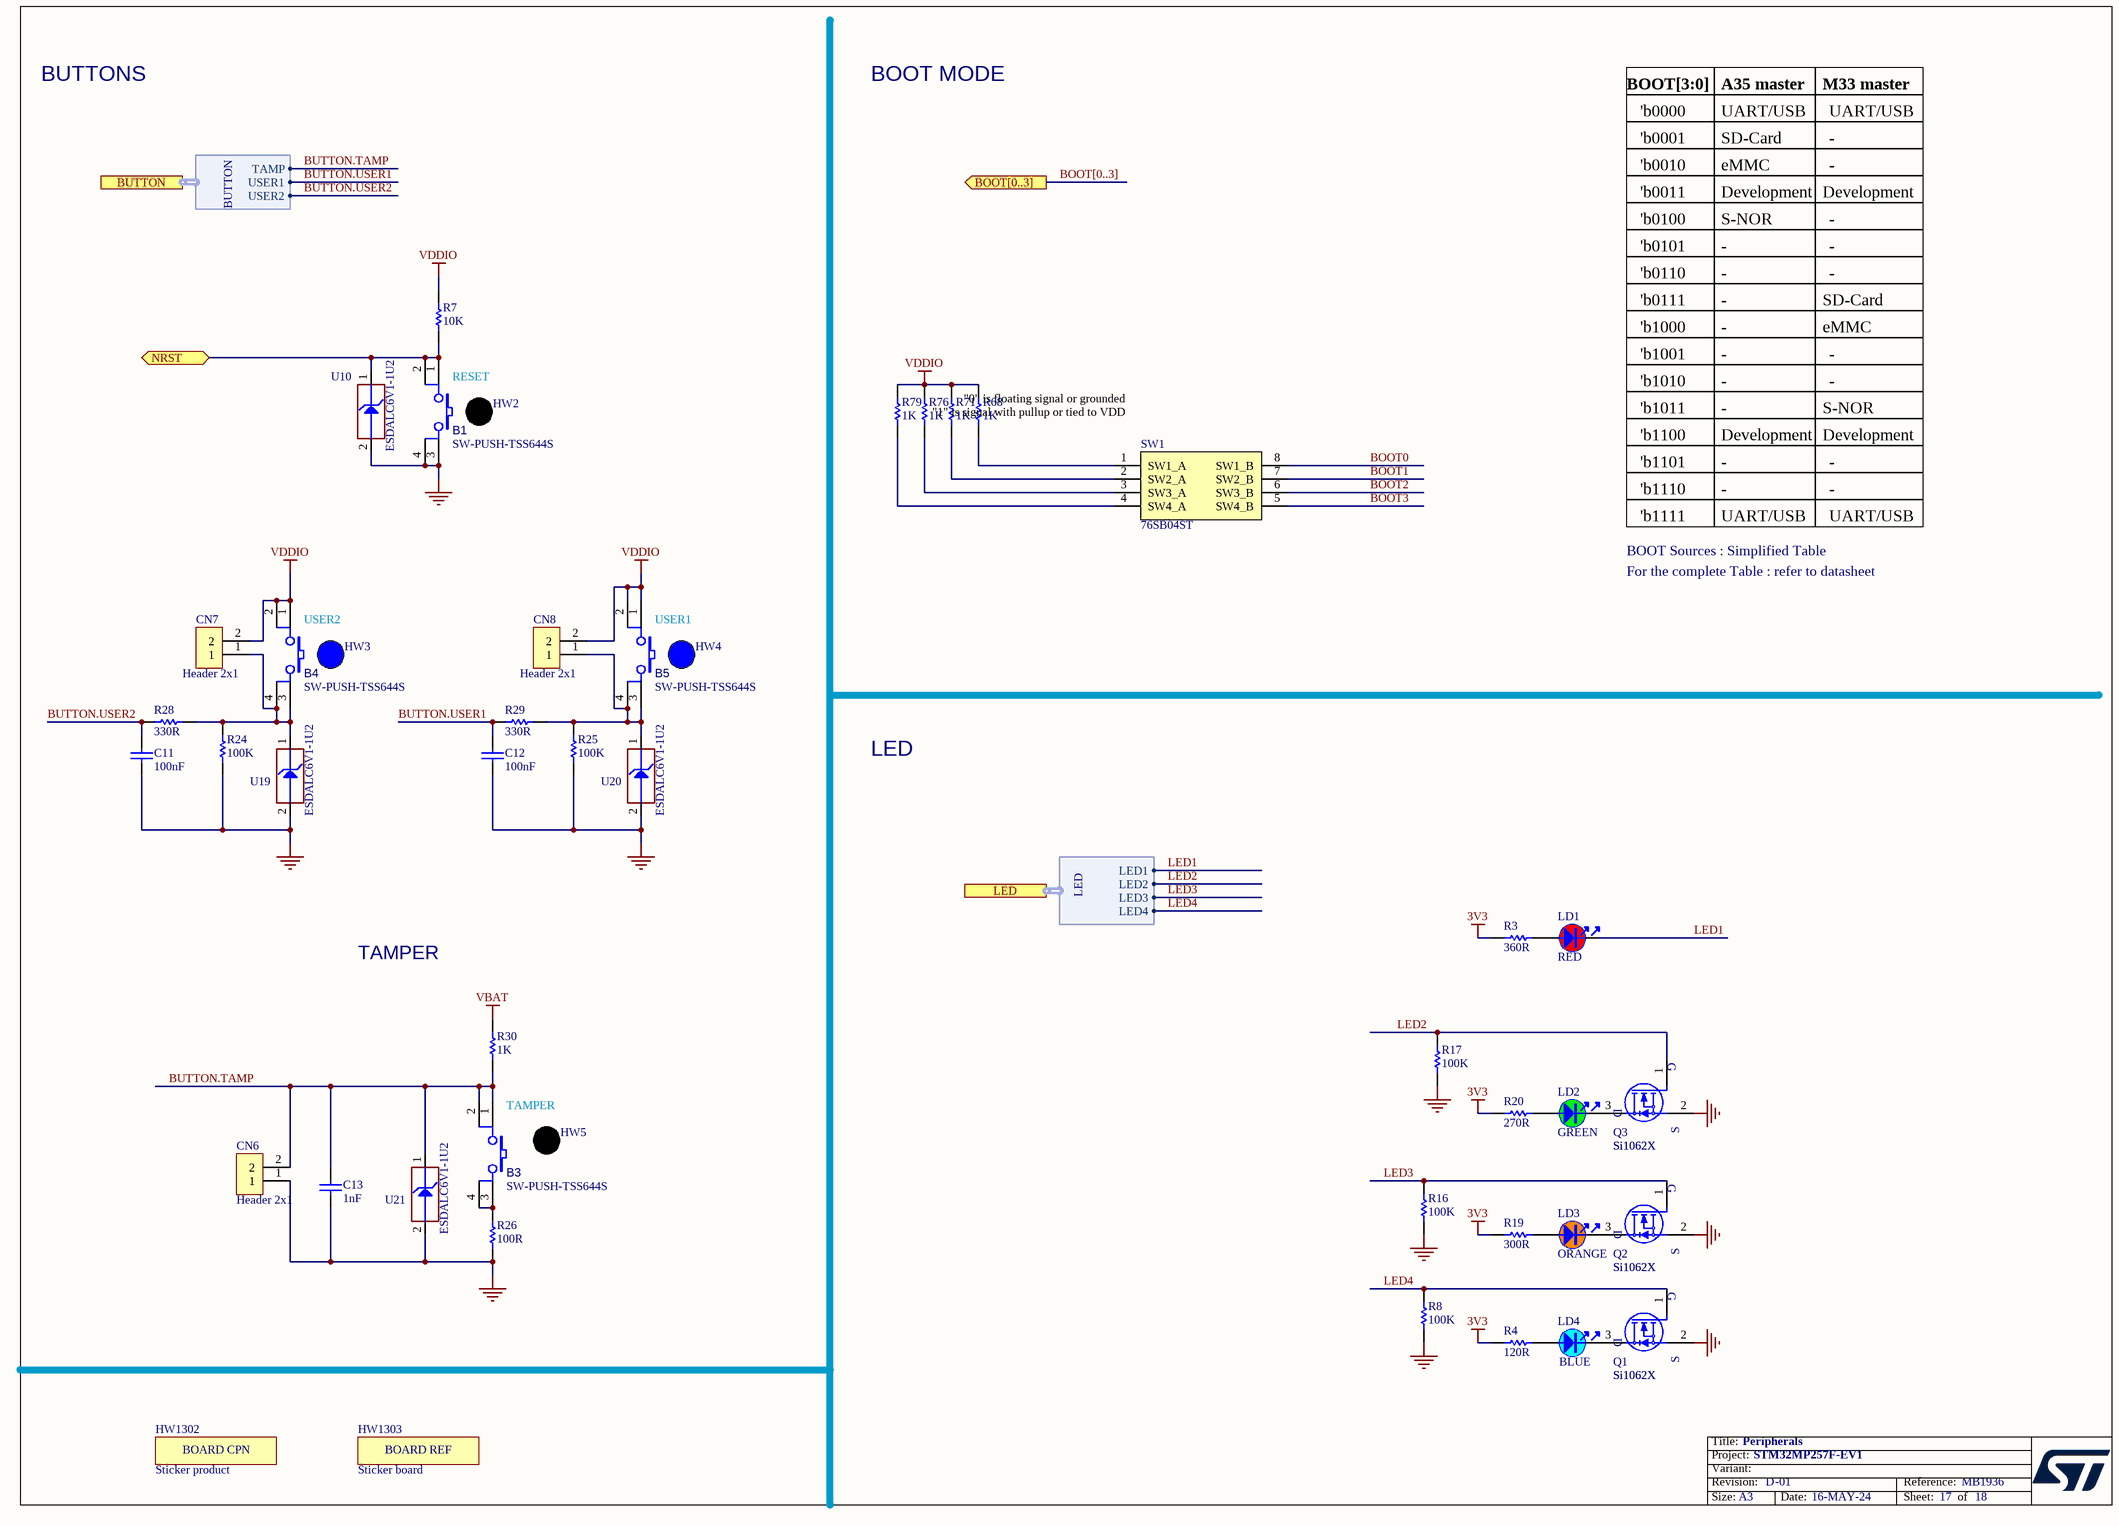
[diagram p9: Peripherals.SchDoc]

### Parts
B1  value SW-PUSH-TSS644S  [SWI_KNITTER_TSS644S]  (hidden comment: SW_PUSH_SMD)
B3  value SW-PUSH-TSS644S  [SWI_KNITTER_TSS644S]  (hidden comment: SW_PUSH_SMD)
B4  value SW-PUSH-TSS644S  [SWI_KNITTER_TSS644S]  (hidden comment: SW_PUSH_SMD)
B5  value SW-PUSH-TSS644S  [SWI_KNITTER_TSS644S]  (hidden comment: SW_PUSH_SMD)
C11  value 100nF  [C0402]  (hidden comment: Capacitor)
C12  value 100nF  [C0402]  (hidden comment: Capacitor)
C13  value 1nF  [C0402]  (hidden comment: Capacitor)
CN6  Header 2x1  [CON_SAMTEC_TSW-102-07-G-S]
CN7  Header 2x1  [CON_SAMTEC_TSW-102-07-G-S]
CN8  Header 2x1  [CON_SAMTEC_TSW-102-07-G-S]
HW2  SW-CAP-KTSC-62K  (value not drawn)  (mechanical)
HW3  Blue Hat  (value not drawn)  (mechanical)
HW4  Blue Hat  (value not drawn)  (mechanical)
HW5  SW-CAP-KTSC-62K  (value not drawn)  (mechanical)
HW1302  value Sticker product  [STICKER_BOARD-CPN_25X5]  (hidden comment: ​PCH W35 footprint requested to have a space on board for stickers.)  (mechanical)
HW1303  value Sticker board  [STICKER_BOARD-REF_25X5]  (hidden comment: STICKER_BOARD_REF)  (mechanical)
LD1  value RED  [LED_0603_VISHAY_VLMS1300-GS08_RED_1A2K_H0P8]  (hidden comment: LED_red)
LD2  value GREEN  [LED_0603_OSRAM_LG-Q396-PS-35_GREEN_1A2K_H0P4]  (hidden comment: LED_green)
LD3  value ORANGE  [LED_0603_OSRAM_LO-Q976-PS-25_ORANGE_1A2K_H0P8]  (hidden comment: LED_orange)
LD4  value BLUE  [LED_0603_OSRAM_LB-Q39G-L2OO-35-1_BLUE_1A2K_H0P4]
Q1  value Si1062X  Manufacturer_Part_Number: Si1062X  [MOS_SC89-3L]  (hidden comment: MOSFET_N-CHANNEL)
Q2  value Si1062X  Manufacturer_Part_Number: Si1062X  [MOS_SC89-3L]  (hidden comment: MOSFET_N-CHANNEL)
Q3  value Si1062X  Manufacturer_Part_Number: Si1062X  [MOS_SC89-3L]  (hidden comment: MOSFET_N-CHANNEL)
R3  value 360R  [R0402]  (hidden comment: Resistor)
R4  value 120R  [R0402]
R7  value 10K  [R0402]  (hidden comment: Resistor)
R8  value 100K  [R0402]  (hidden comment: Resistor)
R16  value 100K  [R0402]  (hidden comment: Resistor)
R17  value 100K  [R0402]  (hidden comment: Resistor)
R19  value 300R  [R0402]  (hidden comment: Resistor)
R20  value 270R  [R0402]  (hidden comment: Resistor)
R24  value 100K  [R0402]  (hidden comment: Resistor)
R25  value 100K  [R0402]  (hidden comment: Resistor)
R26  value 100R  [R0402]  (hidden comment: Resistor)
R28  value 330R  [R0402]  (hidden comment: Resistor)
R29  value 330R  [R0402]  (hidden comment: Resistor)
R30  value 1K  [R0402]  (hidden comment: Resistor)
R68  value 1K  [R0402]  (hidden comment: Resistor)
R71  value 1K  [R0402]  (hidden comment: Resistor)
R76  value 1K  [R0402]  (hidden comment: Resistor)
R79  value 1K  [R0402]  (hidden comment: Resistor)
SW1  76SB04ST  [SWI_GRAYHILL-INC_76SB04ST]
U10  value ESDALC6V1-1U2  [ESD_ST0201]  (hidden comment: ESD-TRANSIL)
U19  value ESDALC6V1-1U2  [ESD_ST0201]  (hidden comment: ESD-TRANSIL)
U20  value ESDALC6V1-1U2  [ESD_ST0201]  (hidden comment: ESD-TRANSIL)
U21  value ESDALC6V1-1U2  [ESD_ST0201]  (hidden comment: ESD-TRANSIL)

### Ports
BOOT[0..3] (out), BUTTON (harness BUTTON), LED (harness LED), NRST (bidir)

### Harnesses
BUTTON: TAMP, USER1, USER2
LED: LED1, LED2, LED3, LED4

### Nets
3V3: R3.1 R4.1 R19.2 R20.2
GND: B1.3 B1.4 C11.1 C12.1 C13.1 CN6.1 Q1.2(S) Q2.2(S) Q3.2(S) R8.1 R16.1 R17.1 R24.1 R25.1 R26.2 U10.2(GND) U19.2(GND) U20.2(GND) U21.2(GND)
VBAT: R30.2
VDDIO: B4.1 B4.2 B5.1 B5.2 CN7.2 CN8.2 R7.2 R68.2 R71.2 R76.2 R79.2
BOOT0: SW1.8(SW1_B)
BOOT1: SW1.7(SW2_B)
BOOT2: SW1.6(SW3_B)
BOOT3: SW1.5(SW4_B)
BUTTON.TAMP: B3.1 B3.2 C13.2 CN6.2 R30.1 U21.1(IO1) ; port BUTTON.TAMP
BUTTON.User1: C12.2 R29.1 ; port BUTTON.USER1
BUTTON.User2: C11.2 R28.1 ; port BUTTON.USER2
LED1: LD1.2 ; port LED.LED1
LED2: Q3.1(G) R17.2 ; port LED.LED2
LED3: Q2.1(G) R16.2 ; port LED.LED3
LED4: Q1.1(G) R8.2 ; port LED.LED4
NRST: B1.1 B1.2 R7.1 U10.1(IO1) ; port NRST
NetB3_3: B3.3 B3.4 R26.1
NetB4_3: B4.3 B4.4 CN7.1 R24.2 R28.2 U19.1(IO1)
NetB5_3: B5.3 B5.4 CN8.1 R25.2 R29.2 U20.1(IO1)
NetLD1_1: LD1.1 R3.2
NetLD2_1: LD2.1 R20.1
NetLD2_2: LD2.2 Q3.3(D)
NetLD3_1: LD3.1 R19.1
NetLD3_2: LD3.2 Q2.3(D)
NetLD4_1: LD4.1 R4.2
NetLD4_2: LD4.2 Q1.3(D)
NetR68_1: R68.1 SW1.1(SW1_A)
NetR71_1: R71.1 SW1.2(SW2_A)
NetR76_1: R76.1 SW1.3(SW3_A)
NetR79_1: R79.1 SW1.4(SW4_A)

### Buses and harness runs
bus BOOT[0..3] = port BOOT[0..3]

### Notes on the sheet
- BUTTONS
- BOOT MODE
- BOOT[3:0]
- A35 master
- M33 master
- 'b0001
- 'b0000
- 'b0010
- UART/USB
- SD-Card
- eMMC
- -
- 'b0011
- 'b0100
- Development
- S-NOR
- 'b0101
- 'b0110
- 'b0111
- (near B1) RESET
- 'b1000
- 'b1001
- "0" is floating signal or grounded
- (near SW1) "1" is signal with pullup or tied to VDD
- 'b1010
- 'b1011
- 'b1100
- 'b1101
- 'b1110
- BOOT Sources : Simplified Table
- For the complete Table : refer to datasheet
- 'b1111
- USER2
- USER1
- LED
- TAMPER
- (near B3) TAMPER
- Title:
- Project:
- Size:
- Revision:
- Variant:
- A3
- Date:
- Reference:
- Sheet:
- of
- (in symbol MCD-00235) BOARD REF
- (in symbol MCD-00547) BOARD CPN

### Library data of the parts
B1 B4 B5 = MCD-02417: Push Button, NO, 0.05A, 12V, 2.6N, SMD, 9.0x6.2mm, T=7.3mm, changeable caps KTSC-6xx; Manufacturer_Part_Number: TSS644S; Manufacturer: KNITTER-SWITCH; Part_Type: Misc; Part_Preference: Recommended; Component_Country_Of_Origin: China; ID: 4523; ShowFields: YES; Internal_Part_Number: MCD-02417; Status: Released; ComponentLink1URL: http://tunmcdsvn.tun.st.com/Component_Documentation_Library/Trunk/Misc/KNITTER_TSS6x_Series; Order_Code_Digikey: N/A; Order_Code_Farnell: N/A; Order_Code_RS: N/A; Alternate_Manufacturer: N/A; Alternate_Manufacturer_Part_Number: N/A; Package: 9.0x6.2mm
B3 = MCD-02417: Push Button, NO, 0.05A, 12V, 2.6N, SMD, 9.0x6.2mm, T=7.3mm, changeable caps KTSC-6xx; Part_Type: Misc; Manufacturer_Part_Number: TSS644S; Manufacturer: KNITTER-SWITCH; Part_Preference: Recommended; Component_Country_Of_Origin: China; ShowFields: YES; ID: 4523; Internal_Part_Number: MCD-02417; Status: Released; ComponentLink1URL: http://tunmcdsvn.tun.st.com/Component_Documentation_Library/Trunk/Misc/KNITTER_TSS6x_Series; Order_Code_Digikey: N/A; Order_Code_Farnell: N/A; Order_Code_RS: N/A; Package: 9.0x6.2mm
C11 C12 = MCD-00006: Capacitor, MLCC, 100nF, 16V, X7R, +/-10%, 0402, T=0.5mm; Manufacturer_Part_Number: CC0402KRX7R7BB104; Manufacturer: YAGEO; Part_Preference: Recommended; Alternate_Manufacturer: MURATA; Alternate_Manufacturer_Part_Number: GCM155R71C104KA55D; Order_Code_RS: 616-9701; Component_Country_Of_Origin: China; ID: 2474; ShowFields: YES; Internal_Part_Number: MCD-00006; Status: Released; Part_Type: Capacitor; Package: 0402; ComponentLink1Description: Datasheet; ComponentLink1URL: http://tunmcdsvn.tun.st.com/Component_Documentation_Library/Trunk/Capacitor/YAGEO_X7R_Series; Order_Code_Digikey: 311-1338-1-ND; Order_Code_Farnell: 9402047
C13 = MCD-00198: Capacitor, MLCC, 1nF, 16V, X7R, +/-10%, 0402, T=0.5mm; Part_Preference: Recommended; Manufacturer: YAGEO; Manufacturer_Part_Number: CC0402KRX7R7BB102; Component_Country_Of_Origin: China; ShowFields: YES; ID: 2665; Internal_Part_Number: MCD-00198; Status: Released; Part_Type: Capacitor; Package: 0402; ComponentLink1URL: http://tunmcdsvn.tun.st.com/Component_Documentation_Library/Trunk/Capacitor/YAGEO_X7R_Series; Order_Code_Digikey: 311-1352-1-ND; Order_Code_Farnell: 2370642; Order_Code_RS: N/A
CN6-CN8 = MCD-00032: Header, 2x1, 2,54mm, VR, TH, Height 5.84mm/2.54mm; Part_Type: Connector; Part_Preference: Recommended; Manufacturer: SAMTEC; Manufacturer_Part_Number: TSW-102-07-G-S; Alternate_Manufacturer: JIUBABA; Alternate_Manufacturer_Part_Number: 313102S111116; Component_Country_Of_Origin: China, Costa Rica, Malaysia, United States, Vietnam; Order_Code_RS: 155-5312; ID: 2484; ShowFields: YES; Internal_Part_Number: MCD-00032; Value: Header 2x1; Status: Released; ComponentLink1URL: http://tunmcdsvn.tun.st.com/Component_Documentation_Library/Trunk/Connector/SAMTEC_TSW_Series/; Order_Code_Digikey: SAM1029-02-ND; Order_Code_Farnell: 2505044
HW2 HW5 = MCD-02420: Black round cap for TSS6x series; Part_Type: Mechanical; Part_Preference: Recommended; Manufacturer: KNITTER-SWITCH; Component_Country_Of_Origin: China; ID: 4526; ShowFields: YES; Value: SW-CAP-KTSC-62K; Order_code_Digikey: N/A; Order_code_Farnell: N/A; Order_code_RS: N/A; Status: Released; ComponentLink1URL: http://tunmcdsvn.tun.st.com/Component_Documentation_Library/Trunk/Mechanical/KNITTER-SWITCH_KTSC-62_Series; Internal_Part_Number: MCD-02420; Manufacturer_Part_Number: KTSC-62K; Alternate_Manufacturer: N/A; Alternate_Manufacturer_Part_Number: N/A
HW3 HW4 = MCD-02136: Switch hat, blue, For KTSC-62B; Part_Type: Misc; Part_Preference: Recommended; Manufacturer: APEM INC; Manufacturer_Part_Number: AKTSC62B; Alternate_Manufacturer: KNITTER-SWITCH; Order_Code_RS: 378-6779; Component_Country_Of_Origin: Unknown; ID: 4236; ShowFields: YES; Value: Blue Hat; Order_Code_Digikey: AKTSC62B-ND; Order_Code_Farnell: N/A; Status: Released; ComponentLink1URL: http://tunmcdsvn.tun.st.com/Component_Datasheet_Library/Trunk/Mechanical/APEM_BLUEHAT_KTSC62; Internal_Part_Number: MCD-02136; Alternate_Manufacturer_Part_Number: KTSC-62B
HW1302 = MCD-00547: Sticker to mention board CPN code; Part_Type: Misc; Part_Preference: Recommended; Provided_By: SUBCO; Initial_Board_Reference: MB1319; ID: 3197; ShowFields: YES; Internal_Part_Number: MCD-00547; Status: Released; Manufacturer_Part_Number: n/a; Manufacturer: n/a; ComponentLink1Description: Datasheet; ComponentLink1URL: N/A; ECCN_US: n/a; ECCN_EU: n/a; Order_Code_Digikey: N/A; Order_Code_Farnell: N/A; Order_Code_RS: N/A
HW1303 = MCD-00235: Sticker to mention board reference + serial number; Part_Type: Misc; Part_Preference: Recommended; Provided_By: SUBCO; Initial_Board_Reference: MB1319; ID: 2632; ShowFields: YES; Internal_Part_Number: MCD-00235; Status: Released; Manufacturer_Part_Number: n/a; Manufacturer: n/a; ComponentLink1Description: Datasheet; ComponentLink1URL: n/a; ECCN_US: n/a; ECCN_EU: n/a; Order_Code_Digikey: N/A; Order_Code_Farnell: N/A; Order_Code_RS: N/A
LD1 = MCD-00587: LED Red, 0603 SMD, 2V Forward Voltage; Part_Type: Display; Manufacturer_Part_Number: VLMS1300-GS08; Manufacturer: VISHAY; Alternate_Manufacturer_Part_Number: LS Q976-NR-1; Alternate_Manufacturer: OSRAM OPTO SEMICONDUCTORS; Alternate_Internal_Part_Number: MCD-02401; Part_Preference: Recommended; Provided_By: SUBCO; Component_Country_Of_Origin: China; ID: 3154; ShowFields: YES; Internal_Part_Number: MCD-00587; Status: Released; Package: LED 0603; ComponentLink1Description: Datasheet; ComponentLink1URL: http://tunmcdsvn.tun.st.com/Component_Datasheet_Library/Trunk/Display/VISHAY_LED_RED_VLMS1300-GS08; Order_Code_Digikey: VLMS1300-GS08CT-ND; Order_Code_Farnell: 2078728; ECCN_US: n/a; ECCN_EU: n/a
LD2 = MCD-00588: as LD7 on sheet Ethernet2; Internal_Part_Number: MCD-00588; Status: Released; Package: LED 0603; ComponentLink1Description: Datasheet; ComponentLink1URL: http://tunmcdsvn.tun.st.com/Component_Datasheet_Library/Trunk/Display/OSRAM_LED_GREEN_LG Q396-PS-35; Order_Code_Digikey: LG Q396-PS-35-ND; ECCN_US: n/a; ECCN_EU: n/a
LD3 = MCD-00590: LED Orange, 0603 SMD, Forward Voltage Min=1.6V, Max=2.4V; Part_Type: Display; Manufacturer_Part_Number: LO Q976-PS-25; Manufacturer: OSRAM OPTO SEMICONDUCTORS; Alternate_Manufacturer_Part_Number: VLMO1300-GS08; Alternate_Manufacturer: VISHAY SEMICONDUCTOR OPTO DIVISION; Part_Preference: Recommended; Provided_By: SUBCO; Component_Country_Of_Origin: Unknown; ID: 3156; ShowFields: YES; Internal_Part_Number: MCD-00590; Status: Released; Package: LED 0603; ComponentLink1Description: Datasheet; ComponentLink1URL: http://tunmcdsvn.tun.st.com/Component_Datasheet_Library/Trunk/Display/OSRAM_LED_ORANGE_LO Q976-PS-25; ECCN_US: n/a; ECCN_EU: n/a
LD4 = MCD-00585: LED Blue, 0603 SMD, Forward Voltage Min=2,8V, Max=3,8V; Part_Type: Display; Manufacturer_Part_Number: LB Q39G-L2OO-35-1; Manufacturer: OSRAM OPTO SEMICONDUCTORS; Alternate_Manufacturer_Part_Number: 19-217-BHC-ZL1M2RY-3T-V4; Alternate_Manufacturer: EVERLIGHT; Alternate_Internal_Part_Number: MCD-02398; Part_Preference: Recommended; Order_Code_RS: 9148643; Provided_By: SUBCO; Component_Country_Of_Origin: Unknown; ID: 3159; ShowFields: YES; Internal_Part_Number: MCD-00585; Status: Released; Package: LED 0603; ComponentLink1Description: Datasheet; ComponentLink1URL: http://tunmcdsvn.tun.st.com/Component_Datasheet_Library/Trunk/Display/OSRAM_LED_BLUE_LB Q39G-L2OO-35-1; Order_Code_Digikey: 475-2816-1-ND; ECCN_US: n/a; ECCN_EU: n/a
Q1-Q3 = MCD-02221: MOSFET N-CH 20V SC-89; Part_Preference: Recommended; Part_Type: Transistor; Manufacturer: VISHAY; Order_Code_RS: 812-3044; Component_Country_Of_Origin: Philippines; ID: 4321; ShowFields: YES; Internal_Part_Number: MCD-02221; Status: Checked; Package: SC-89; ComponentLink1Description: Part_Information; ComponentLink1URL: http://tunmcdsvn.tun.st.com/Component_Datasheet_Library/Trunk/Transistors/VISHAY_Si1062X; Alternate_Manufacturer: N/A; Alternate_Manufacturer_Part_Number: N/A; Order_Code_Digikey: SI1062X-T1-GE3CT-ND; Order_Code_Farnell: 2646363
R3 = MCD-00461: Resistor,360R,0402,1%,1/16W; Manufacturer_Part_Number: RC0402FR-07360RL; Manufacturer: YAGEO; Part_Preference: Recommended; Provided_By: SUBCO; ECCN_US: EAR99; ECCN_EU: NEC; Component_Country_Of_Origin: China; ID: 2816; ShowFields: YES; Internal_Part_Number: MCD-00461; Status: Released; Part_Type: Resistor; Package: 0402; ComponentLink1Description: Datasheet; ComponentLink1URL: http://tunmcdsvn.tun.st.com/Component_Documentation_Library/Trunk/Resistor/YAGEO_RC_L_Series; Order_Code_Digikey: YAG3132CT-ND; Order_Code_Farnell: 1458786; Order_Code_RS: N/A
R4 = MCD-00194: Resistor,120R,0402,1%,1/16W; Manufacturer_Part_Number: RC0402FR-07120RL; Manufacturer: YAGEO; Part_Preference: Recommended; Provided_By: SUBCO; ECCN_US: EAR99; ECCN_EU: NEC; Component_Country_Of_Origin: China; ID: 2674; ShowFields: YES; Internal_Part_Number: MCD-00194; Status: Released; Part_Type: Resistor; Package: 0402; ComponentLink1Description: Datasheet; ComponentLink1URL: http://tunmcdsvn.tun.st.com/Component_Documentation_Library/Trunk/Resistor/YAGEO_RC_L_Series; Order_Code_Digikey: 311-120LRCT-ND; Order_Code_Farnell: 9239120; Order_Code_RS: N/A
R7 = MCD-00053: Resistor,10K,0402,1%,1/16W; Manufacturer_Part_Number: RC0402FR-0710KL; Manufacturer: YAGEO; BMS_Part_Number: 9131590; Part_Preference: Recommended; Component_Country_Of_Origin: China; ID: 2539; ShowFields: YES; Internal_Part_Number: MCD-00053; ComponentLink1Description: Datasheet; Status: Released; Part_Type: Resistor; ComponentLink1URL: http://tunmcdsvn.tun.st.com/Component_Documentation_Library/Trunk/Resistor/YAGEO_RC_L_Series; Package: 0402; Order_Code_Digikey: 311-10.0KLRCT-ND; Order_Code_Farnell: 9239359; Order_Code_RS: N/A; Alternate_Manufacturer: N/A; Alternate_Manufacturer_Part_Number: N/A
R8 R16 R17 R24 R25 = MCD-00059: Resistor,100K,0402,1%,1/16W; Manufacturer_Part_Number: RC0402FR-07100KL; Manufacturer: YAGEO; Alternate_Manufacturer_Part_Number: RT0402FRE07100KL; Part_Preference: Recommended; Component_Country_Of_Origin: China; ID: 2533; ShowFields: YES; Internal_Part_Number: MCD-00059; Status: Released; Part_Type: Resistor; Alternate_Manufacturer: YAGEO; Package: 0402; ComponentLink1Description: Datasheet; ComponentLink1URL: http://tunmcdsvn.tun.st.com/Component_Documentation_Library/Trunk/Resistor/YAGEO_RC_L_Series; Order_Code_Digikey: 311-100KLRTR-ND; Order_Code_Farnell: 2421891; Order_Code_RS: N/A
R19 = MCD-00449: Resistor,300R,0402,1%,1/16W; Manufacturer_Part_Number: RC0402FR-07300RL; Manufacturer: YAGEO; Part_Preference: Recommended; Provided_By: SUBCO; ECCN_US: EAR99; ECCN_EU: NEC; Component_Country_Of_Origin: China; ID: 2832; ShowFields: YES; Internal_Part_Number: MCD-00449; Status: Released; Part_Type: Resistor; Package: 0402; ComponentLink1Description: Datasheet; ComponentLink1URL: http://tunmcdsvn.tun.st.com/Component_Documentation_Library/Trunk/Resistor/YAGEO_RC_L_Series; Order_Code_Digikey: 311-300LRCT-ND; Order_Code_Farnell: 1458776; Order_Code_RS: N/A
R20 = MCD-00441: as R126 on sheet Ethernet2; Internal_Part_Number: MCD-00441; Status: Released; Part_Type: Resistor; Package: 0402; ComponentLink1Description: Datasheet; ComponentLink1URL: http://tunmcdsvn.tun.st.com/Component_Documentation_Library/Trunk/Resistor/YAGEO_RC_L_Series; Order_Code_Digikey: 311-270LRCT-ND; Order_Code_Farnell: 9239162; Order_Code_RS: N/A
R26 = MCD-00067: Resistor, 100R, 0402, +/- 1%, 1/16W; Manufacturer_Part_Number: RC0402FR-07100RL; Manufacturer: YAGEO; Part_Preference: Recommended; Component_Country_Of_Origin: China; ShowFields: YES; ID: 2527; Internal_Part_Number: MCD-00067; Status: Released; Part_Type: Resistor; ComponentLink1URL: http://tunmcdsvn.tun.st.com/Component_Documentation_Library/Trunk/Resistor/YAGEO_RC_L_Series; Package: 0402; Order_Code_Digikey: 311-100LRCT-ND; Order_Code_Farnell: 9239111; Order_Code_RS: N/A
R28 R29 = MCD-00062: Resistor,330R,0402,1%,1/16W; Manufacturer_Part_Number: RC0402FR-07330RL; Manufacturer: YAGEO; Part_Preference: Recommended; Component_Country_Of_Origin: China; ID: 2529; ShowFields: YES; Internal_Part_Number: MCD-00062; Status: Released; Part_Type: Resistor; Package: 0402; ComponentLink1Description: Datasheet; ComponentLink1URL: http://tunmcdsvn.tun.st.com/Component_Documentation_Library/Trunk/Resistor/YAGEO_RC_L_Series; Order_Code_Digikey: 311-330LRCT-ND; Order_Code_Farnell: 9239170; Order_Code_RS: N/A; Alternate_Manufacturer: N/A; Alternate_Manufacturer_Part_Number: N/A
R30 = MCD-00061: Resistor, 1K, 0402, +/-1%,1/16W; Manufacturer_Part_Number: RC0402FR-071KL; Manufacturer: YAGEO; Part_Preference: Recommended; Component_Country_Of_Origin: China; ShowFields: YES; ID: 2532; Internal_Part_Number: MCD-00061; Status: Released; Part_Type: Resistor; ComponentLink1URL: http://tunmcdsvn.tun.st.com/Component_Documentation_Library/Trunk/Resistor/YAGEO_RC_L_Series; Package: 0402; Order_Code_Digikey: 311-1.00KLRCT-ND; Order_Code_Farnell: 9239235; Order_Code_RS: N/A
R68 R71 R76 R79 = MCD-00061: Resistor,1K,0402,1%,1/16W; Part_Preference: Recommended; Manufacturer: YAGEO; Manufacturer_Part_Number: RC0402FR-071KL; Component_Country_Of_Origin: China; ID: 2532; ShowFields: YES; Internal_Part_Number: MCD-00061; Status: Released; Part_Type: Resistor; Package: 0402; ComponentLink1Description: Datasheet; ComponentLink1URL: http://tunmcdsvn.tun.st.com/Component_Documentation_Library/Trunk/Resistor/YAGEO_RC_L_Series; Order_Code_Digikey: 311-1.00KLRCT-ND; Order_Code_Farnell: 9239235; Order_Code_RS: N/A; Alternate_Manufacturer: N/A; Alternate_Manufacturer_Part_Number: N/A
SW1 = MCD-02256: Quad SPST switch, TH, 2.54mm pitch, height 7.5mm; Part_Preference: Recommended; Part_Type: Misc; Manufacturer: GRAYHILL; Alternate_Manufacturer: TE Connectivity; Alternate_Manufacturer_Part_Number: 5435640-2; Order_Code_RS: 878-0230; Component_Country_Of_Origin: China; ID: 4356; ShowFields: YES; ComponentLink1URL: http://tunmcdsvn.tun.st.com/Component_Datasheet_Library/Trunk/Misc/GRAYHILL_DIP_Series_76_SPST; ComponentLink1Description: Part_Information; Internal_Part_Number: MCD-02256; Value: 76SB04ST; Status: Released; Manufacturer_Part_Number: 76SB04ST; Package: DIP8 2.54mm pitch; Order_Code_Digikey: GH7169-ND; Order_Code_Farnell: 9479007
U10 U19-U21 = MCD-00170: ESD protection 6V1; Part_Type: Diode; Manufacturer: STMICROELECTRONICS; BMS_Part_Number: 9151132; Part_Preference: Recommended; Manufacturer_HQ_COO: EU; Component_Country_Of_Origin: China; ID: 2696; ShowFields: YES; Internal_Part_Number: MCD-00170; Status: Released; Manufacturer_Part_Number: ESDALC6V1-1U2; ComponentLink1Description: Datasheet; ComponentLink1URL: http://tunmcdsvn.tun.st.com/Component_Datasheet_Library/Trunk/Diodes/STM_ESD_ESDALC6V1-1U2